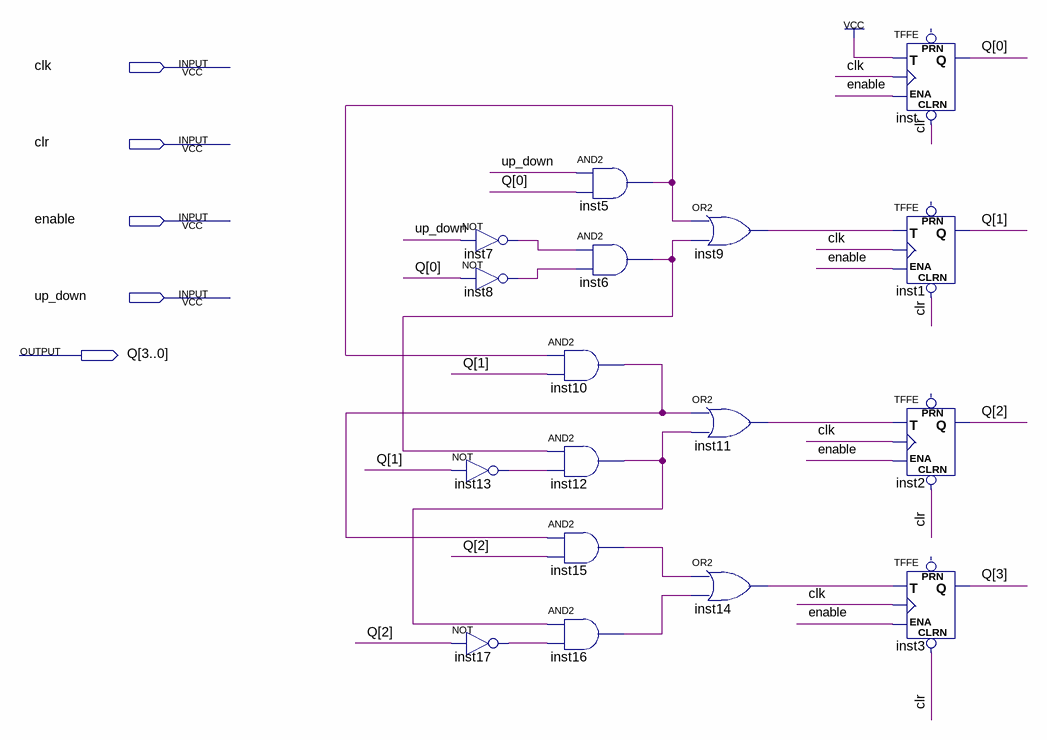
[diagram p0: schematic sheet]
// Quartus schematic fourBitCounter.bdf as structural Verilog: 17 symbols, 5 pins
module fourBitCounter (
  input  clk,
  input  clr,
  input  enable,
  input  up_down,
  output [3:0] Q
);

  wire inst5_out, inst6_out, inst7_out, inst8_out, inst9_out, inst10_out, inst11_out, inst12_out, inst13_out,
       inst14_out, inst15_out, inst16_out, inst17_out;

  not inst7 (inst7_out, up_down);
  not inst8 (inst8_out, Q[0]);
  not inst13 (inst13_out, Q[1]);
  not inst17 (inst17_out, Q[2]);
  and inst10 (inst10_out, inst5_out, Q[1]);
  and inst12 (inst12_out, inst6_out, inst13_out);
  and inst15 (inst15_out, inst10_out, Q[2]);
  and inst16 (inst16_out, inst12_out, inst17_out);
  and inst5 (inst5_out, up_down, Q[0]);
  and inst6 (inst6_out, inst7_out, inst8_out);
  or inst9 (inst9_out, inst5_out, inst6_out);
  or inst11 (inst11_out, inst10_out, inst12_out);
  or inst14 (inst14_out, inst15_out, inst16_out);
  TFFE inst (.CLRN(clr), .T(1'b1), .CLK(clk), .ENA(enable), .Q(Q[0]));  // open: PRN
  TFFE inst1 (.CLRN(clr), .T(inst9_out), .CLK(clk), .ENA(enable), .Q(Q[1]));  // open: PRN
  TFFE inst2 (.CLRN(clr), .T(inst11_out), .CLK(clk), .ENA(enable), .Q(Q[2]));  // open: PRN
  TFFE inst3 (.CLRN(clr), .T(inst14_out), .CLK(clk), .ENA(enable), .Q(Q[3]));  // open: PRN
endmodule
